# Altium schematic sheet Heaters.SchDoc: Land Meter Heater Assembly
size Tabloid; DocumentNumber: LM_HTR_001; Revision: A; SheetNumber: 1; SheetTotal: 1
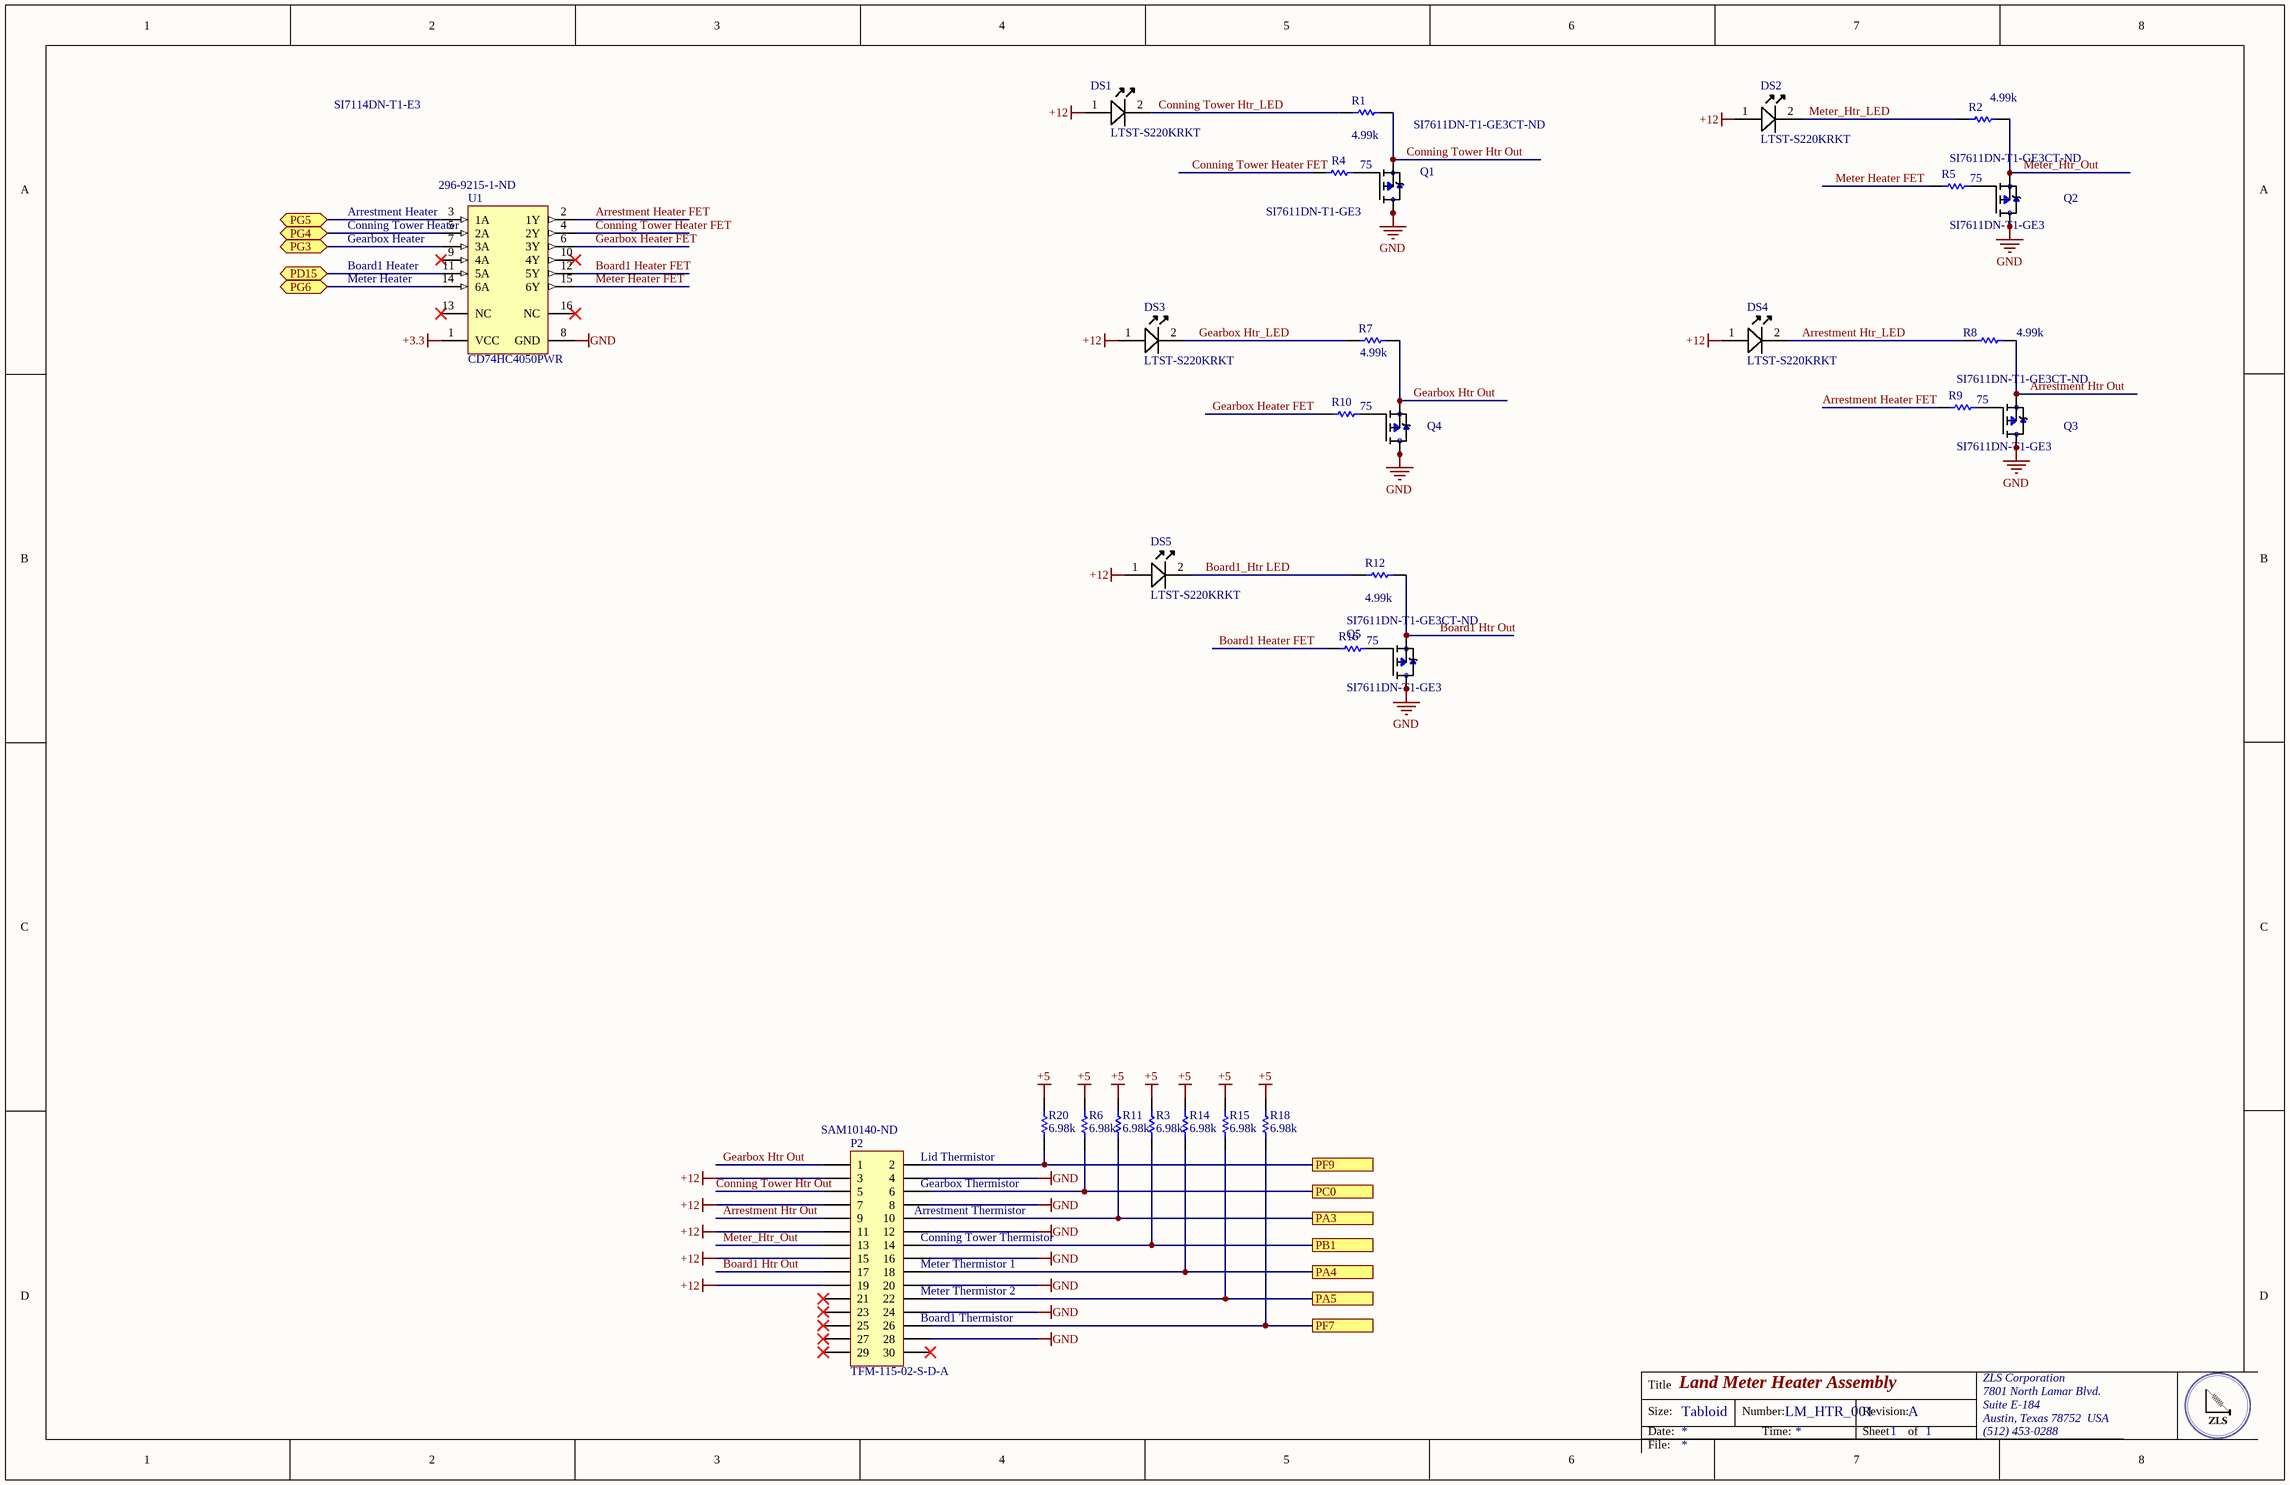
[diagram p0: Heaters.SchDoc]

## Parts
DS1  Manufacturer Part Number: LTST-S220KRKT  [0805C_L]  (hidden comment: Visible Name Value Type    False Description Lite-On LTST-S220KRKT Red LED, 631 nm 2012 (0805) Side View, Rectangle Lens SMD package STRING)
DS2  Manufacturer Part Number: LTST-S220KRKT  [0805C_L]  (hidden comment: Visible Name Value Type    False Description Lite-On LTST-S220KRKT Red LED, 631 nm 2012 (0805) Side View, Rectangle Lens SMD package STRING)
DS3  Manufacturer Part Number: LTST-S220KRKT  [0805C_L]  (hidden comment: Visible Name Value Type    False Description Lite-On LTST-S220KRKT Red LED, 631 nm 2012 (0805) Side View, Rectangle Lens SMD package STRING)
DS4  Manufacturer Part Number: LTST-S220KRKT  [0805C_L]  (hidden comment: Visible Name Value Type    False Description Lite-On LTST-S220KRKT Red LED, 631 nm 2012 (0805) Side View, Rectangle Lens SMD package STRING)
DS5  Manufacturer Part Number: LTST-S220KRKT  [0805C_L]  (hidden comment: Visible Name Value Type    False Description Lite-On LTST-S220KRKT Red LED, 631 nm 2012 (0805) Side View, Rectangle Lens SMD package STRING)
P2  TFM-115-02-S-D-A  Supplier Part Number 1: SAM10140-ND  [TFM-115-02-S-D-A - duplicate]
Q1  SI7611DN-T1-GE3  Supplier Part Number 1: SI7611DN-T1-GE3CT-ND  [*VISHAY_SIS468DN-T1-GE3]
Q2  SI7611DN-T1-GE3  Supplier Part Number 1: SI7611DN-T1-GE3CT-ND  [*VISHAY_SIS468DN-T1-GE3]
Q3  SI7611DN-T1-GE3  Supplier Part Number 1: SI7611DN-T1-GE3CT-ND  [*VISHAY_SIS468DN-T1-GE3]
Q4  SI7611DN-T1-GE3  [*VISHAY_SIS468DN-T1-GE3]  (value not drawn)
Q5  SI7611DN-T1-GE3  Supplier Part Number 1: SI7611DN-T1-GE3CT-ND  [*VISHAY_SIS468DN-T1-GE3]
R1  Resistance (Ohms): 4.99k  [RESC0805(2012)_L]
R2  Resistance (Ohms): 4.99k  [RESC0805(2012)_L]
R3  Resistance (Ohms): 6.98k  [RESC0805(2012)_N]  (hidden comment: 6K98 1% 0805(2012))
R4  Resistance (Ohms): 75  [RESC0805(2012)_L]
R5  Resistance (Ohms): 75  [RESC0805(2012)_L]
R6  Resistance (Ohms): 6.98k  [RESC0805(2012)_N]  (hidden comment: 6K98 1% 0805(2012))
R7  Resistance (Ohms): 4.99k  [RESC0805(2012)_L]
R8  Resistance (Ohms): 4.99k  [RESC0805(2012)_L]
R9  Resistance (Ohms): 75  [RESC0805(2012)_L]
R10  Resistance (Ohms): 75  [RESC0805(2012)_L]
R11  Resistance (Ohms): 6.98k  [RESC0805(2012)_N]  (hidden comment: 6K98 1% 0805(2012))
R12  Resistance (Ohms): 4.99k  [RESC0805(2012)_L]
R14  Resistance (Ohms): 6.98k  [RESC0805(2012)_N]  (hidden comment: 6K98 1% 0805(2012))
R15  Resistance (Ohms): 6.98k  [RESC0805(2012)_N]  (hidden comment: 6K98 1% 0805(2012))
R16  Resistance (Ohms): 75  [RESC0805(2012)_L]
R18  Resistance (Ohms): 6.98k  [RESC0805(2012)_N]  (hidden comment: 6K98 1% 0805(2012))
R20  Resistance (Ohms): 6.98k  [RESC0805(2012)_N]  (hidden comment: 6K98 1% 0805(2012))
U1  CD74HC4050PWR  Supplier Part Number 1: 296-9215-1-ND  [PW0016A_N]

## Ports
PA3, PA4, PA5, PB1, PC0, PD15, PF7, PF9, PG3, PG4, PG5, PG6

## Nets
+3.3: U1.1(VCC)
+5: R3.2 R6.2 R11.1 R14.1 R15.2 R18.1 R20.1
+12: DS1.1(A) DS2.1(A) DS3.1(A) DS4.1(A) DS5.1(A) P2.3 P2.7 P2.11 P2.15 P2.19
GND: P2.4 P2.8 P2.12 P2.16 P2.20 P2.24 P2.28 Q1.5(D) Q1.6(D) Q1.7(D) Q1.8(D) Q1.9(D) Q2.5(D) Q2.6(D) Q2.7(D) Q2.8(D) Q2.9(D) Q3.5(D) Q3.6(D) Q3.7(D) Q3.8(D) Q3.9(D) Q4.5(D) Q4.6(D) Q4.7(D) Q4.8(D) Q4.9(D) Q5.5(D) Q5.6(D) Q5.7(D) Q5.8(D) Q5.9(D) U1.8(GND)
Arrestment Heater FET: R9.1 U1.2(1Y)
Arrestment Htr Out: P2.9 Q3.1(S) Q3.2(S) Q3.3(S) R8.2
Arrestment Htr_LED: DS4.2(K) R8.1
Board1 Heater FET: R16.1 U1.12(5Y)
Board1 Htr Out: P2.17 Q5.1(S) Q5.2(S) Q5.3(S) R12.1
Board1_Htr LED: DS5.2(K) R12.2
Conning Tower Heater FET: R4.1 U1.4(2Y)
Conning Tower Htr Out: P2.5 Q1.1(S) Q1.2(S) Q1.3(S) R1.1
Conning Tower Htr_LED: DS1.2(K) R1.2
Gearbox Heater FET: R10.1 U1.6(3Y)
Gearbox Htr Out: P2.1 Q4.1(S) Q4.2(S) Q4.3(S) R7.1
Gearbox Htr_LED: DS3.2(K) R7.2
Meter Heater FET: R5.1 U1.15(6Y)
Meter_Htr_LED: DS2.2(K) R2.1
Meter_Htr_Out: P2.13 Q2.1(S) Q2.2(S) Q2.3(S) R2.2
PA3: P2.10 R11.2 ; port PA3
PA4: P2.18 R14.2 ; port PA4
PA5: P2.22 R15.1 ; port PA5
PB1: P2.14 R3.1 ; port PB1
PC0: P2.6 R6.1 ; port PC0
PD15: U1.11(5A) ; port PD15
PF7: P2.26 R18.2 ; port PF7
PF9: P2.2 R20.2 ; port PF9
PG3: U1.7(3A) ; port PG3
PG4: U1.5(2A) ; port PG4
PG5: U1.3(1A) ; port PG5
PG6: U1.14(6A) ; port PG6
NetQ1_4: Q1.4(G) R4.2
NetQ2_4: Q2.4(G) R5.2
NetQ3_4: Q3.4(G) R9.2
NetQ4_4: Q4.4(G) R10.2
NetQ5_4: Q5.4(G) R16.2

Not connected (* = marked no-connect by the designer): P2 21* 23* 25* 27* 29* 30*; U1 9(4A)* 10(4Y)* 13(NC)* 16(NC)*

## Notes on the sheet
- SI7114DN-T1-E3
- (near U1) Arrestment Heater
- (near U1) Conning Tower Heater
- (near U1) Gearbox Heater
- (near U1) Board1 Heater
- (near U1) Meter Heater
- (near P2) Lid Thermistor
- (near P2) Arrestment Thermistor
- (near P2) Gearbox Thermistor
- (near P2) Conning Tower Thermistor
- (near P2) Meter Thermistor 1
- (near P2) Meter Thermistor 2
- (near P2) Board1 Thermistor
- Title
- Size:
- Date:
- Tabloid
- Number:
- Time:
- Revision:
- Sheet
- of
- ZLS Corporation
- 7801 North Lamar Blvd.
- Suite E-184
- Austin, Texas 78752  USA
- (512) 453-0288
- File:

## Library data of the parts
DS1-DS5 = LED A/K: Manufacturer: Vishay / Lite-On; Lens Colour: Colorless; Lens Style: Diffused,Colorless; Viewing Angle: 130°; Luminous Intensity: 54mcd; Forward Current: 20mA; Forward Voltage: 2V; Power Rating: 75mW; Dominant Wavelength: 631nm; Lens Transparency: Clear; Number of Elements: 1; Wavelength: 639nm; Supplier 1: Digi-Key; Supplier Part Number 1: 160-1469-1-ND; Stock 1: 108191; Pricing 1: 1=0.31, 10=0.225, 25=0.1656, 100=0.1183, 250=0.0804, 500=0.071, 1000=0.0556 (USD); Mount: Surface Mount; Case/Package: 0805; Number of Pins: 2; Colour: Red; Case Code (Metric): 2012; Case Code (Imperial): 0805; Min Operating Temperature: -55°C; Max Operating Temperature: 85°C; Packaging: Tape and Reel; Package Quantity: 4000; Illumination Colour: Red; Test Current: 20mA; Power Dissipation: 75mW; Number of LEDs: 1; Length: 2.1mm; Height: 0.6mm; Width: 1mm; Depth: 0.6mm; Radiation Hardening: No; Lead Free: Lead Free; ComponentLink1URL: https://datasheet.ciiva.com/2110/s-110-ltst-s220krkt-2110132.pdf; ComponentLink1Description: https://datasheet.ciiva.com/2110/s-110-ltst-s220krkt-2110132.pdf; ComponentLink2URL: https://datasheet.ciiva.com/2110/s-110-ltst-s220krkt-2110133.pdf; ComponentLink2Description: https://datasheet.ciiva.com/2110/s-110-ltst-s220krkt-2110133.pdf; ComponentLink3URL: https://datasheet.ciiva.com/2110/s-110-ltst-s220krkt-2110134.pdf; ComponentLink3Description: https://datasheet.ciiva.com/2110/s-110-ltst-s220krkt-2110134.pdf; ComponentLink4URL: https://datasheet.ciiva.com/12403/lite-on-ltst-s220krkt-187389-12403798.pdf; ComponentLink4Description: https://datasheet.ciiva.com/12403/lite-on-ltst-s220krkt-187389-12403798.pdf; ComponentLink5URL: https://datasheet.ciiva.com/16345/lite-onltst-s220krkt-16345511.pdf; ComponentLink5Description: https://datasheet.ciiva.com/16345/lite-onltst-s220krkt-16345511.pdf; ComponentLink6URL: https://datasheet.ciiva.com/15118/getdatasheetpartid-225752-15118120.pdf; ComponentLink6Description: https://datasheet.ciiva.com/15118/getdatasheetpartid-225752-15118120.pdf; ComponentLink7URL: https://datasheet.ciiva.com/14633/0900766b80dc0b76-14633737.pdf; ComponentLink7Description: https://datasheet.ciiva.com/14633/0900766b80dc0b76-14633737.pdf; ComponentLink8URL: https://datasheet.ciiva.com/11775/0900766b80dc0b76-11775439.pdf; ComponentLink8Description: https://datasheet.ciiva.com/11775/0900766b80dc0b76-11775439.pdf
P2 = Header 15X2H: Header, 15-Pin, Dual row, Right Angle; Manufacturer: Samtec; Number of Contacts: 30; Gender: Male; Max Voltage Rating (AC): 350V; Current Rating: 2A; Pitch: 1.27mm; LatestRevisionDate: 17-Jul-2002; LatestRevisionNote: Re-released for DXP Platform.; Publisher: Altium Limited; Supplier 1: Digi-Key; Manufacturer Part Number: TFM-115-02-S-D-A; Stock 1: 262; Pricing 1: 1=6.02000, 26=5.27115, 104=4.76904, 520=4.01600, 1014=3.51400 (USD); RoHS: Yes; Contact Plating: Gold; Contact Material: Bronze; Housing Color: Black; Housing Material: Polymer; Min Operating Temperature: -55°C; Max Operating Temperature: 125°C; Number of Rows: 2; Termination: Solder; Packaging: Bulk; Orientation: Straight; Voltage Rating: 350V; Length: 22.23mm; Depth: 5.72mm; Radiation Hardening: No; REACH SVHC: No SVHC; ComponentLink1URL: https://datasheet.ciiva.com/23730/tfm-1xx-xx-xxx-x-xxx-mkt-23730881.pdf?src-supplier=Newark; ComponentLink1Description: https://datasheet.ciiva.com/23730/tfm-1xx-xx-xxx-x-xxx-mkt-23730881.pdf?src-supplier=Newark; ComponentLink2URL: https://datasheet.ciiva.com/11748/0900766b803e8a8f-11748828.pdf?src-supplier=RSComponents; ComponentLink2Description: https://datasheet.ciiva.com/11748/0900766b803e8a8f-11748828.pdf?src-supplier=RSComponents; ComponentLink3URL: https://datasheet.ciiva.com/22665/1909334-22665886.pdf?src-supplier=Element14; ComponentLink3Description: https://datasheet.ciiva.com/22665/1909334-22665886.pdf?src-supplier=Element14
Q1-Q5 = SI7611DN-T1-GE3: P-Channel 40 V 0.025 Ohm 39 W Surface Mount Power Mosfet - PowerPAK-1212-8; MF: Vishay Siliconix; Rds On Max: 25mR; Input Capacitance: 1.98nF; Nominal Vgs: -3V; Rise Time: 11ns; Drain to Source Voltage (Vdss): 40V; Continuous Drain Current (ID): 9.3A; Max Power Dissipation: 39W; Gate to Source Voltage (Vgs): 20V; Fall Time: 9ns; Turn-Off Delay Time: 30ns; Threshold Voltage: -1V; Number of Elements: 1; Power Dissipation: 3.7W; Drain to Source Breakdown Voltage: -40V; Turn-On Delay Time: 10ns; Digi-Key_Part_Number: SI7611DN-T1-GE3CT-ND; Package: PowerPAKÂ®-1212 Vishay; SnapEDA_Link: https://www.snapeda.com/parts/SI7611DN-T1-GE3/Vishay%20Siliconix/view-part/?ref=snap; Digi-Key_Purchase_URL: https://www.digikey.com/product-detail/en/vishay-siliconix/SI7611DN-T1-GE3/SI7611DN-T1-GE3CT-ND/1978912?utm_source=snapeda&utm_medium=aggregator&utm_campaign=symbol; MP: SI7611DN-T1-GE3; Value: *; Supplier 1: Digi-Key; Manufacturer: Vishay Siliconix; Manufacturer Part Number: SI7611DN-T1-GE3; Stock 1: 17511; Pricing 1: 1=1.69000, 10=1.51900, 100=1.22090, 500=1.00310, 1000=0.83113 (USD); RoHS: Yes; Mount: Surface Mount; Number of Pins: 8; Min Operating Temperature: -50°C; Max Operating Temperature: 150°C; Package Quantity: 3000; Packaging: Tape and Reel; Drain to Source Resistance: 25mR; Number of Channels: 1; On-State Resistance: 25mR; Length: 3.05mm; Height: 1.04mm; Width: 3.05mm; Radiation Hardening: No; REACH SVHC: Unknown; Lead Free: Lead Free; ComponentLink1URL: https://datasheet.ciiva.com/16217/si7611dn-16217425.pdf?src-supplier=Future+Electronics; ComponentLink1Description: https://datasheet.ciiva.com/16217/si7611dn-16217425.pdf?src-supplier=Future+Electronics; ComponentLink2URL: https://datasheet.ciiva.com/22652/1719651-22652413.pdf?src-supplier=Element14; ComponentLink2Description: https://datasheet.ciiva.com/22652/1719651-22652413.pdf?src-supplier=Element14; ComponentLink3URL: https://datasheet.ciiva.com/4441/si7611dn-244617-4441134.pdf?src-supplier=Mouser; ComponentLink3Description: https://datasheet.ciiva.com/4441/si7611dn-244617-4441134.pdf?src-supplier=Mouser; ComponentLink4URL: https://datasheet.ciiva.com/26791/si7611dn-t1-ge3-26791896.pdf?src-supplier=IIIC; ComponentLink4Description: https://datasheet.ciiva.com/26791/si7611dn-t1-ge3-26791896.pdf?src-supplier=IIIC; ComponentLink5URL: https://datasheet.ciiva.com/933/si7611dn-933572.pdf?src-supplier=Digi-Key; ComponentLink5Description: https://datasheet.ciiva.com/933/si7611dn-933572.pdf?src-supplier=Digi-Key; ComponentLink6URL: https://datasheet.ciiva.com/933/si7611dn-933574.pdf?src-supplier=Digi-Key; ComponentLink6Description: https://datasheet.ciiva.com/933/si7611dn-933574.pdf?src-supplier=Digi-Key; ComponentLink7URL: https://datasheet.ciiva.com/22671/si7611dn-22671641.pdf?src-supplier=Element14; ComponentLink7Description: https://datasheet.ciiva.com/22671/si7611dn-22671641.pdf?src-supplier=Element14; ComponentLink8URL: https://datasheet.ciiva.com/933/si7611dn-933573.pdf?src-supplier=Digi-Key; ComponentLink8Description: https://datasheet.ciiva.com/933/si7611dn-933573.pdf?src-supplier=Digi-Key; ComponentLink9URL: https://datasheet.ciiva.com/11159/si7611dn-11159816.pdf?src-supplier=Avnet; ComponentLink9Description: https://datasheet.ciiva.com/11159/si7611dn-11159816.pdf?src-supplier=Avnet
  Q4: Supplier Part Number 1: SI7611DN-T1-GE3CT-ND
R1 R2 R7 R8 R12 = CMP-1013-00393-1: Manufacturer: Vishay Dale; Manufacturer Part Number: CRCW08054K99FKEA; Tolerance: ±1%; Power (Watts): 0.125W, 1/8W; Temperature Coefficient: ±100ppm/°C; Supplier 1: Digi-Key; Supplier Part Number 1: 541-4.99KCCT-ND; RoHS: RoHS Compliant; Category: Resistors; Stock 1: 93740; Pricing 1: 1=0.1, 10=0.044, 100=0.0178, 1000=0.00802, 2500=0.00696 (USD); Packaging: Cut Tape (CT); Part Status: Active; Composition: Thick Film; Features: Automotive AEC-Q200; Operating Temperature: -55°C ~ 155°C; Package / Case: 0805 (2012 Metric); Supplier Device Package: 0805; Size / Dimension: 0.079" L x 0.049" W (2.00mm x 1.25mm); Height - Seated (Max): 0.020" (0.50mm); Failure Rate: -; ComponentLink1URL: http://www.vishay.com/docs/20035/dcrcwe3.pdf; ComponentLink1Description: http://www.vishay.com/docs/20035/dcrcwe3.pdf
R3 R6 R11 R14 R15 R18 R20 = CMP-1013-00606-1: 6K98 0.125W 1% 0805 (2012 Metric)  SMD; Manufacturer: Vishay Dale; Manufacturer Part Number: CRCW08056K98FKEA; Power (Watts): 0.125W, 1/8W; Temperature Coefficient: ±100ppm/°C; Supplier 1: Digi-Key; Supplier Part Number 1: 541-6.98KCCT-ND; RoHS: RoHS Compliant; Category: Resistors; Stock 1: 34245; Pricing 1: 1=0.1, 10=0.044, 100=0.0178, 1000=0.00802, 2500=0.00696 (USD); Packaging: Cut Tape (CT); Part Status: Active; Tolerance: ±1%; Composition: Thick Film; Features: Automotive AEC-Q200; Operating Temperature: -55°C ~ 155°C; Package / Case: 0805 (2012 Metric); Supplier Device Package: 0805; Size / Dimension: 0.079" L x 0.049" W (2.00mm x 1.25mm); Height - Seated (Max): 0.020" (0.50mm); Failure Rate: -; ComponentLink1URL: http://www.vishay.com/docs/20035/dcrcwe3.pdf; ComponentLink1Description: http://www.vishay.com/docs/20035/dcrcwe3.pdf
R4 R5 R9 R10 R16 = CMP-1013-00393-1: Manufacturer: Vishay Dale; Manufacturer Part Number: CRCW080575R0FKEA; Tolerance: ±1%; Power (Watts): 0.125W, 1/8W; Temperature Coefficient: ±100ppm/°C; Supplier 1: Digi-Key; Supplier Part Number 1: 541-75.0CCT-ND; RoHS: RoHS Compliant; Category: Resistors; Stock 1: 32546; Pricing 1: 1=0.1, 10=0.044, 100=0.0178, 1000=0.00802, 2500=0.00696 (USD); Packaging: Cut Tape (CT); Part Status: Active; Composition: Thick Film; Features: Automotive AEC-Q200; Operating Temperature: -55°C ~ 155°C; Package / Case: 0805 (2012 Metric); Supplier Device Package: 0805; Size / Dimension: 0.079" L x 0.049" W (2.00mm x 1.25mm); Height - Seated (Max): 0.020" (0.50mm); Failure Rate: -; ComponentLink1URL: http://www.vishay.com/docs/20035/dcrcwe3.pdf; ComponentLink1Description: http://www.vishay.com/docs/20035/dcrcwe3.pdf
U1 = CMP-0440-01131-3: High Speed CMOS Logic Hex Non-Inverting Buffers, PW0016A, LARGE T&R; Manufacturer: Texas Instruments; VCC(Min)(V): 2; Rating: Catalog; tpd @ Nom Voltage(Max)(ns): 18; Voltage(Nom)(V): 6; F @ Nom Voltage(Max)(Mhz): 28; ICC @ Nom Voltage(Max)(mA): 0.02; Propagation Delay: 14ns; Max Supply Voltage: 6V; Min Supply Voltage: 2V; Logic Function: Buffer; Number of Bits per Element: 1; High Level Output Current: -5.2mA; Low Level Output Current: 5.2mA; Quiescent Current: 2uA; Input Type: CMOS; Output Type: CMOS; PackageVersion: http://www.ti.com/lit/ml/mpds361/mpds361.pdf; DatasheetVersion: SCHS205I; Operating Temperature Range(C): -55 to 125; Generic Part Number: CD74HC4050; Code_JEDEC: MO-153; VCC(Max)(V): 6; PackageReference: PW0016A; Bits(#): 6; Supplier 1: Digi-Key; Manufacturer Part Number: CD74HC4050PWR; Stock 1: 16059; Pricing 1: 1=0.45000, 10=0.38600, 100=0.28840, 500=0.22660, 1000=0.17510 (USD); RoHS: Yes; Mount: Surface Mount; Case/Package: TSSOP; Number of Pins: 16; Contact Plating: Gold; Min Operating Temperature: -55°C; Max Operating Temperature: 125°C; Packaging: Tape and Reel; Number of Channels: 6; Number of Inputs: 6; Number of Outputs: 6; Package Quantity: 2000; Number of Elements: 6; Number of Input Lines: 6; Number of Output Lines: 6; Polarity: Non-Inverting; Turn-On Delay Time: 14ns; Number of Bits: 6; Length: 5mm; Height: 1.15mm; Width: 4.4mm; Radiation Hardening: No; REACH SVHC: No SVHC; Lead Free: Lead Free; ComponentLink1URL: https://datasheet.ciiva.com/46415/1847357-46415243.pdf?src-supplier=Element14; ComponentLink1Description: https://datasheet.ciiva.com/46415/1847357-46415243.pdf?src-supplier=Element14; ComponentLink2URL: https://datasheet.ciiva.com/26248/cd74hc4049-26248317.pdf?src-supplier=Avnet+Europe; ComponentLink2Description: https://datasheet.ciiva.com/26248/cd74hc4049-26248317.pdf?src-supplier=Avnet+Europe; ComponentLink3URL: https://datasheet.ciiva.com/1834/cd74hc4049-1834062.pdf?src-supplier=Digi-Key; ComponentLink3Description: https://datasheet.ciiva.com/1834/cd74hc4049-1834062.pdf?src-supplier=Digi-Key; ComponentLink4URL: https://datasheet.ciiva.com/1834/cd74hc4049-1834063.pdf?src-supplier=Digi-Key; ComponentLink4Description: https://datasheet.ciiva.com/1834/cd74hc4049-1834063.pdf?src-supplier=Digi-Key; ComponentLink5URL: https://datasheet.ciiva.com/14302/schs205i-14302309.pdf?src-supplier=Avnet; ComponentLink5Description: https://datasheet.ciiva.com/14302/schs205i-14302309.pdf?src-supplier=Avnet; ComponentLink6URL: https://datasheet.ciiva.com/1834/cd74hc4049-1834061.pdf?src-supplier=Digi-Key; ComponentLink6Description: https://datasheet.ciiva.com/1834/cd74hc4049-1834061.pdf?src-supplier=Digi-Key; ComponentLink7URL: https://datasheet.ciiva.com/41455/001015781-da-01-en-ic-buffer-hex-cd74hc4050pwr-tssop-16-tid-41455717.pdf?src-supplier=Conrad; ComponentLink7Description: https://datasheet.ciiva.com/41455/001015781-da-01-en-ic-buffer-hex-cd74hc4050pwr-tssop-16-tid-41455717.pdf?src-supplier=Conrad